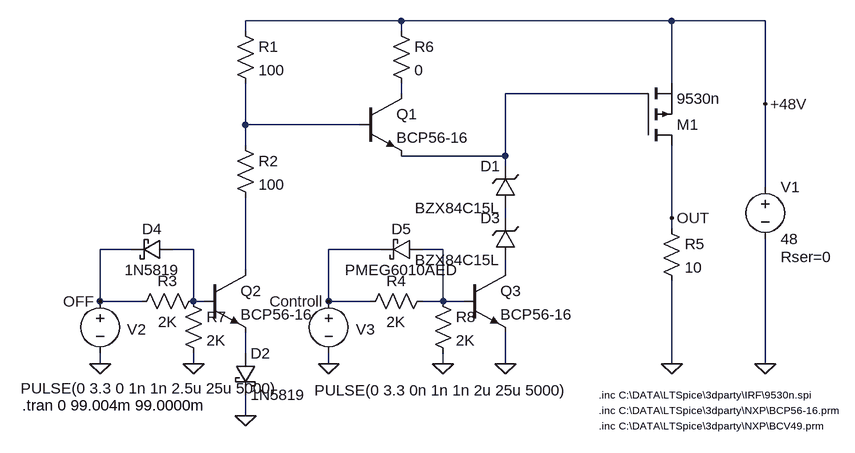
[diagram p0: schematic driver_v3_bipolar_resistive.asc]
driver_v3_bipolar_resistive.asc, the LTspice schematic file:
Version 4
SHEET 1 908 680
WIRE 96 -128 -144 -128
WIRE 512 -128 96 -128
WIRE 656 -128 512 -128
WIRE -144 -112 -144 -128
WIRE 96 -112 96 -128
WIRE 512 -32 512 -128
WIRE 96 -16 96 -32
WIRE 464 -16 256 -16
WIRE 656 0 656 -128
WIRE -144 32 -144 -32
WIRE 32 32 -144 32
WIRE -144 64 -144 32
WIRE 256 80 256 -16
WIRE 256 80 96 80
WIRE 256 96 256 80
WIRE 656 128 656 0
WIRE 256 176 256 160
WIRE 512 176 512 64
WIRE 512 192 512 176
WIRE -320 224 -368 224
WIRE -224 224 -256 224
WIRE 64 224 -16 224
WIRE 160 224 128 224
WIRE -144 256 -144 144
WIRE 256 256 256 240
WIRE -368 304 -368 224
WIRE -304 304 -368 304
WIRE -224 304 -224 224
WIRE -208 304 -224 304
WIRE -16 304 -16 224
WIRE 48 304 -16 304
WIRE 160 304 160 224
WIRE 160 304 128 304
WIRE 192 304 160 304
WIRE -144 384 -144 352
WIRE -368 400 -368 384
WIRE -224 400 -224 384
WIRE -16 400 -16 384
WIRE 160 400 160 384
WIRE 256 400 256 352
WIRE 512 400 512 272
WIRE 656 400 656 208
WIRE -144 480 -144 448
FLAG -144 480 0
FLAG 512 400 0
FLAG 656 400 0
FLAG -368 400 0
FLAG 656 0 +48V
FLAG -16 304 Controll
FLAG 512 176 OUT
FLAG 256 400 0
FLAG -16 400 0
FLAG -368 304 OFF
FLAG -224 400 0
FLAG 160 400 0
SYMBOL pmos 464 64 M180
SYMATTR InstName M1
SYMATTR Value 9530n
SYMATTR Prefix X
SYMBOL npn 32 -16 R0
SYMATTR InstName Q1
SYMATTR Value BCP56-16
SYMATTR Prefix X
SYMBOL res -160 -128 R0
SYMATTR InstName R1
SYMATTR Value 100
SYMBOL res -160 48 R0
SYMATTR InstName R2
SYMATTR Value 100
SYMBOL res 496 176 R0
SYMATTR InstName R5
SYMATTR Value 10
SYMBOL voltage 656 112 R0
WINDOW 123 0 0 Left 2
WINDOW 39 24 124 Left 2
SYMATTR SpiceLine Rser=0
SYMATTR InstName V1
SYMATTR Value 48
SYMBOL voltage -368 288 R0
WINDOW 0 42 59 Left 2
WINDOW 3 -122 150 Left 2
WINDOW 123 0 0 Left 2
WINDOW 39 0 0 Left 2
SYMATTR InstName V2
SYMATTR Value PULSE(0 3.3 0 1n 1n 2.5u 25u 5000)
SYMBOL res 80 -128 R0
SYMATTR InstName R6
SYMATTR Value 0
SYMBOL zener 272 160 R180
WINDOW 0 24 64 Left 2
WINDOW 3 24 0 Left 2
SYMATTR InstName D1
SYMATTR Value BZX84C15L
SYMATTR Description Diode
SYMATTR Type diode
SYMBOL zener 272 240 R180
WINDOW 0 24 64 Left 2
WINDOW 3 24 0 Left 2
SYMATTR InstName D3
SYMATTR Value BZX84C15L
SYMATTR Description Diode
SYMATTR Type diode
SYMBOL voltage -16 288 R0
WINDOW 0 42 59 Left 2
WINDOW 3 -22 153 Left 2
WINDOW 123 0 0 Left 2
WINDOW 39 0 0 Left 2
SYMATTR InstName V3
SYMATTR Value PULSE(0 3.3 0n 1n 1n 2u 25u 5000)
SYMBOL res -208 288 R90
WINDOW 0 0 56 VBottom 2
WINDOW 3 32 56 VTop 2
SYMATTR InstName R3
SYMATTR Value 2K
SYMBOL res 144 288 R90
WINDOW 0 0 56 VBottom 2
WINDOW 3 32 56 VTop 2
SYMATTR InstName R4
SYMATTR Value 2K
SYMBOL npn -208 256 R0
SYMATTR InstName Q2
SYMATTR Value BCP56-16
SYMATTR Prefix X
SYMBOL npn 192 256 R0
SYMATTR InstName Q3
SYMATTR Value BCP56-16
SYMATTR Prefix X
SYMBOL res -240 288 R0
SYMATTR InstName R7
SYMATTR Value 2K
SYMBOL res 144 288 R0
SYMATTR InstName R8
SYMATTR Value 2K
SYMBOL schottky 128 208 R90
WINDOW 0 0 32 VBottom 2
WINDOW 3 32 32 VTop 2
SYMATTR InstName D5
SYMATTR Value PMEG6010AED
SYMATTR Description Diode
SYMATTR Type diode
SYMBOL schottky -160 384 R0
SYMATTR InstName D2
SYMATTR Value 1N5819
SYMATTR Description Diode
SYMATTR Type diode
SYMBOL schottky -256 208 R90
WINDOW 0 0 32 VBottom 2
WINDOW 3 32 32 VTop 2
SYMATTR InstName D4
SYMATTR Value 1N5819
SYMATTR Description Diode
SYMATTR Type diode
TEXT -488 464 Left 2 !.tran 0 99.004m 99.0000m
TEXT 400 448 Left 1 !.inc C:\\DATA\\LTSpice\\3dparty\\IRF\\9530n.spi
TEXT 400 472 Left 1 !.inc C:\\DATA\\LTSpice\\3dparty\\NXP\\BCP56-16.prm
TEXT 400 496 Left 1 !.inc C:\\DATA\\LTSpice\\3dparty\\NXP\\BCV49.prm

The netlist it stands for:
* driver_v3_bipolar_resistive.asc
XM1 OUT N002 +48V 9530n  ; pins D G S
XQ1 N001 N003 N002 BCP56-16  ; pins C B E
R1 +48V N003 100
R2 N003 N007 100
R5 OUT 0 10
V1 +48V 0 48 Rser=0
V2 OFF 0 PULSE(0 3.3 0 1n 1n 2.5u 25u 5000)
R6 +48V N001 0
D1 N004 N002 BZX84C15L
D3 N008 N004 BZX84C15L
V3 Controll 0 PULSE(0 3.3 0n 1n 1n 2u 25u 5000)
R3 N005 OFF 2K
R4 N006 Controll 2K
XQ2 N007 N005 N009 BCP56-16  ; pins C B E
XQ3 N008 N006 0 BCP56-16  ; pins C B E
R7 N005 0 2K
R8 N006 0 2K
D5 N006 Controll PMEG6010AED
D2 N009 0 1N5819
D4 N005 OFF 1N5819
.model D D
.lib standard.dio
.tran 0 99.004m 99.0000m
.inc C:\DATA\LTSpice\3dparty\IRF\9530n.spi
.inc C:\DATA\LTSpice\3dparty\NXP\BCP56-16.prm
.inc C:\DATA\LTSpice\3dparty\NXP\BCV49.prm
.backanno
.end